# EAGLE schematic Power (EAGLE 9.3.0)
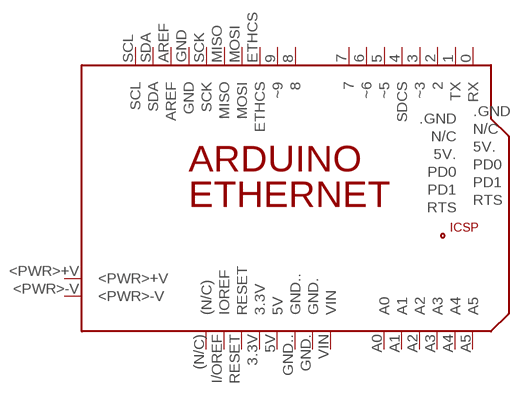
[diagram p0: schematic, sheet 1]

## Parts
PCB1  ARDUINO_ETHERNET  [ARDUINO_ETHERNET]
Unconnected: PCB1.0(RX) PCB1.1(TX) PCB1.2 PCB1.3(~3) PCB1.3.3V PCB1.4(SDCS) PCB1.5(~5) PCB1.5V PCB1.5V. PCB1.6(~6) PCB1.7 PCB1.8 PCB1.9(~9) PCB1.(N/C) PCB1.+5V. PCB1..GND PCB1.<PWR>+V PCB1.<PWR>-V PCB1.A0 PCB1.A1 PCB1.A2 PCB1.A3 PCB1.A4 PCB1.A5 PCB1.AREF PCB1.ETHCS PCB1.GND PCB1.GND. PCB1.GND.. PCB1.GND_ PCB1.I/OREF(IOREF) PCB1.MISO PCB1.MISO. PCB1.MOSI PCB1.MOSI. PCB1.N/C PCB1.PD0 PCB1.PD1 PCB1.RESET PCB1.RESET. PCB1.RTS PCB1.SCK PCB1.SCK. PCB1.SCL PCB1.SDA PCB1.VIN

## Library data of the parts
PCB1 = E14_Arduino_revB:ARDUINO_ETHERNET: Device for representing an Arduino Ethernet board with a footprint in an EAGLE design. Created by Dave Young for Element14. More EAGLE documentation at: http://www.element14.com/community/community/knode/cadsoft_eagle